# EAGLE schematic RFIDPswdAuth (EAGLE 9.5.1)
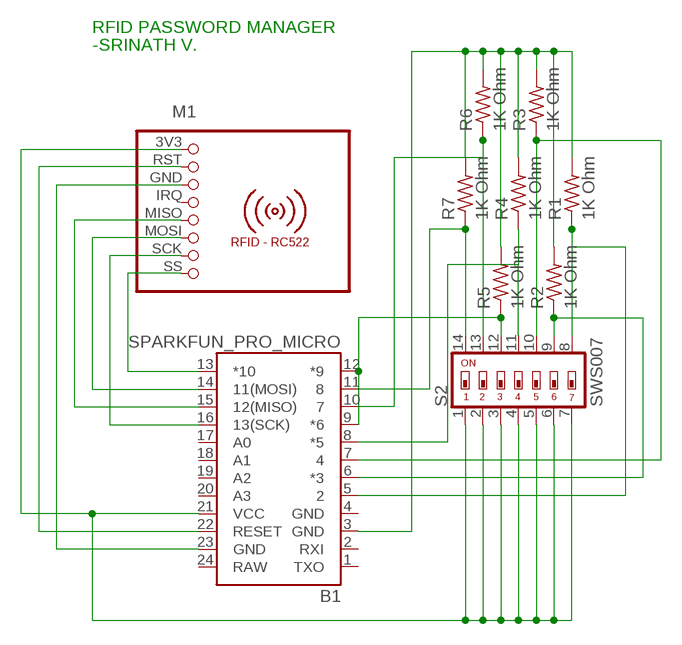
[diagram p0: schematic, sheet 1]

## Parts
B1  SPARKFUN_PRO_MICRO  [SPARKFUN_PRO_MICRO]
M1  RFID-RC522  [RFID-RC522]
R1  1K Ohm  R-US_0204/2V  [0204V]
R2  1K Ohm  R-US_0204/2V  [0204V]
R3  1K Ohm  R-US_0204/2V  [0204V]
R4  1K Ohm  R-US_0204/2V  [0204V]
R5  1K Ohm  R-US_0204/2V  [0204V]
R6  1K Ohm  R-US_0204/2V  [0204V]
R7  1K Ohm  R-US_0204/2V  [0204V]
S2  SWS007  [SMS-007]

## Nets
N$1: B1.21(VCC) M1.3V3 S2.1 S2.2 S2.3 S2.4 S2.5 S2.6 S2.7
N$2: B1.22(RESET) M1.RST
N$3: B1.23(GND) M1.GND
N$4: B1.15(12(MISO)) M1.MISO
N$5: B1.14(11(MOSI)) M1.MOSI
N$6: B1.16(13(SCK)) M1.SCK
N$7: B1.13(*10) M1.SS
N$8: B1.3(GND) R1.2 R2.2 R3.2 R4.2 R5.2 R6.2 R7.2
N$9: B1.5 R1.1 S2.8
N$10: B1.6(*3) R2.1 S2.9
N$11: B1.7 R3.1 S2.10
N$12: B1.8(*5) R4.1 S2.11
N$13: B1.10 R6.1 S2.13
N$14: B1.9(*6) B1.12(*9) R5.1 S2.12
N$15: B1.11 R7.1 S2.14
Unconnected: B1.1(TXO) B1.2(RXI) B1.17(A0) B1.18(A1) B1.19(A2) B1.20(A3) M1.IRQ

## Notes on the sheet
- RFID PASSWORD MANAGER
- -SRINATH V.

## Power pins joined to a net without a drawn wire
GND: B1.4(GND)
RAW: B1.24(RAW)

## Library data of the parts
B1 = SparkFun-Boards:SPARKFUN_PRO_MICRO: SparkFun Pro Micro Atmega32U4 compatible footprint. SparkFun Products: 3.3V/8MHz <https://www.sparkfun.com/products/12587> 5V/16MHz <https://www.sparkfun.com/products/12640>
M1 = mfrc522-module:RFID-RC522: RFID-RC522 MFRC-522 based breakout board
R1-R7 = resistor:R-US_: RESISTOR, American symbol
S2 = smd-special:SWS007: SMD Dip Switch 7 pol.